# EAGLE schematic Timer Autoradio NE555+CD4093 (EAGLE 6.4)
Circuito per mantenere l'autoradio acceso per ancora 15 minuti dopo aver spento la macchina.
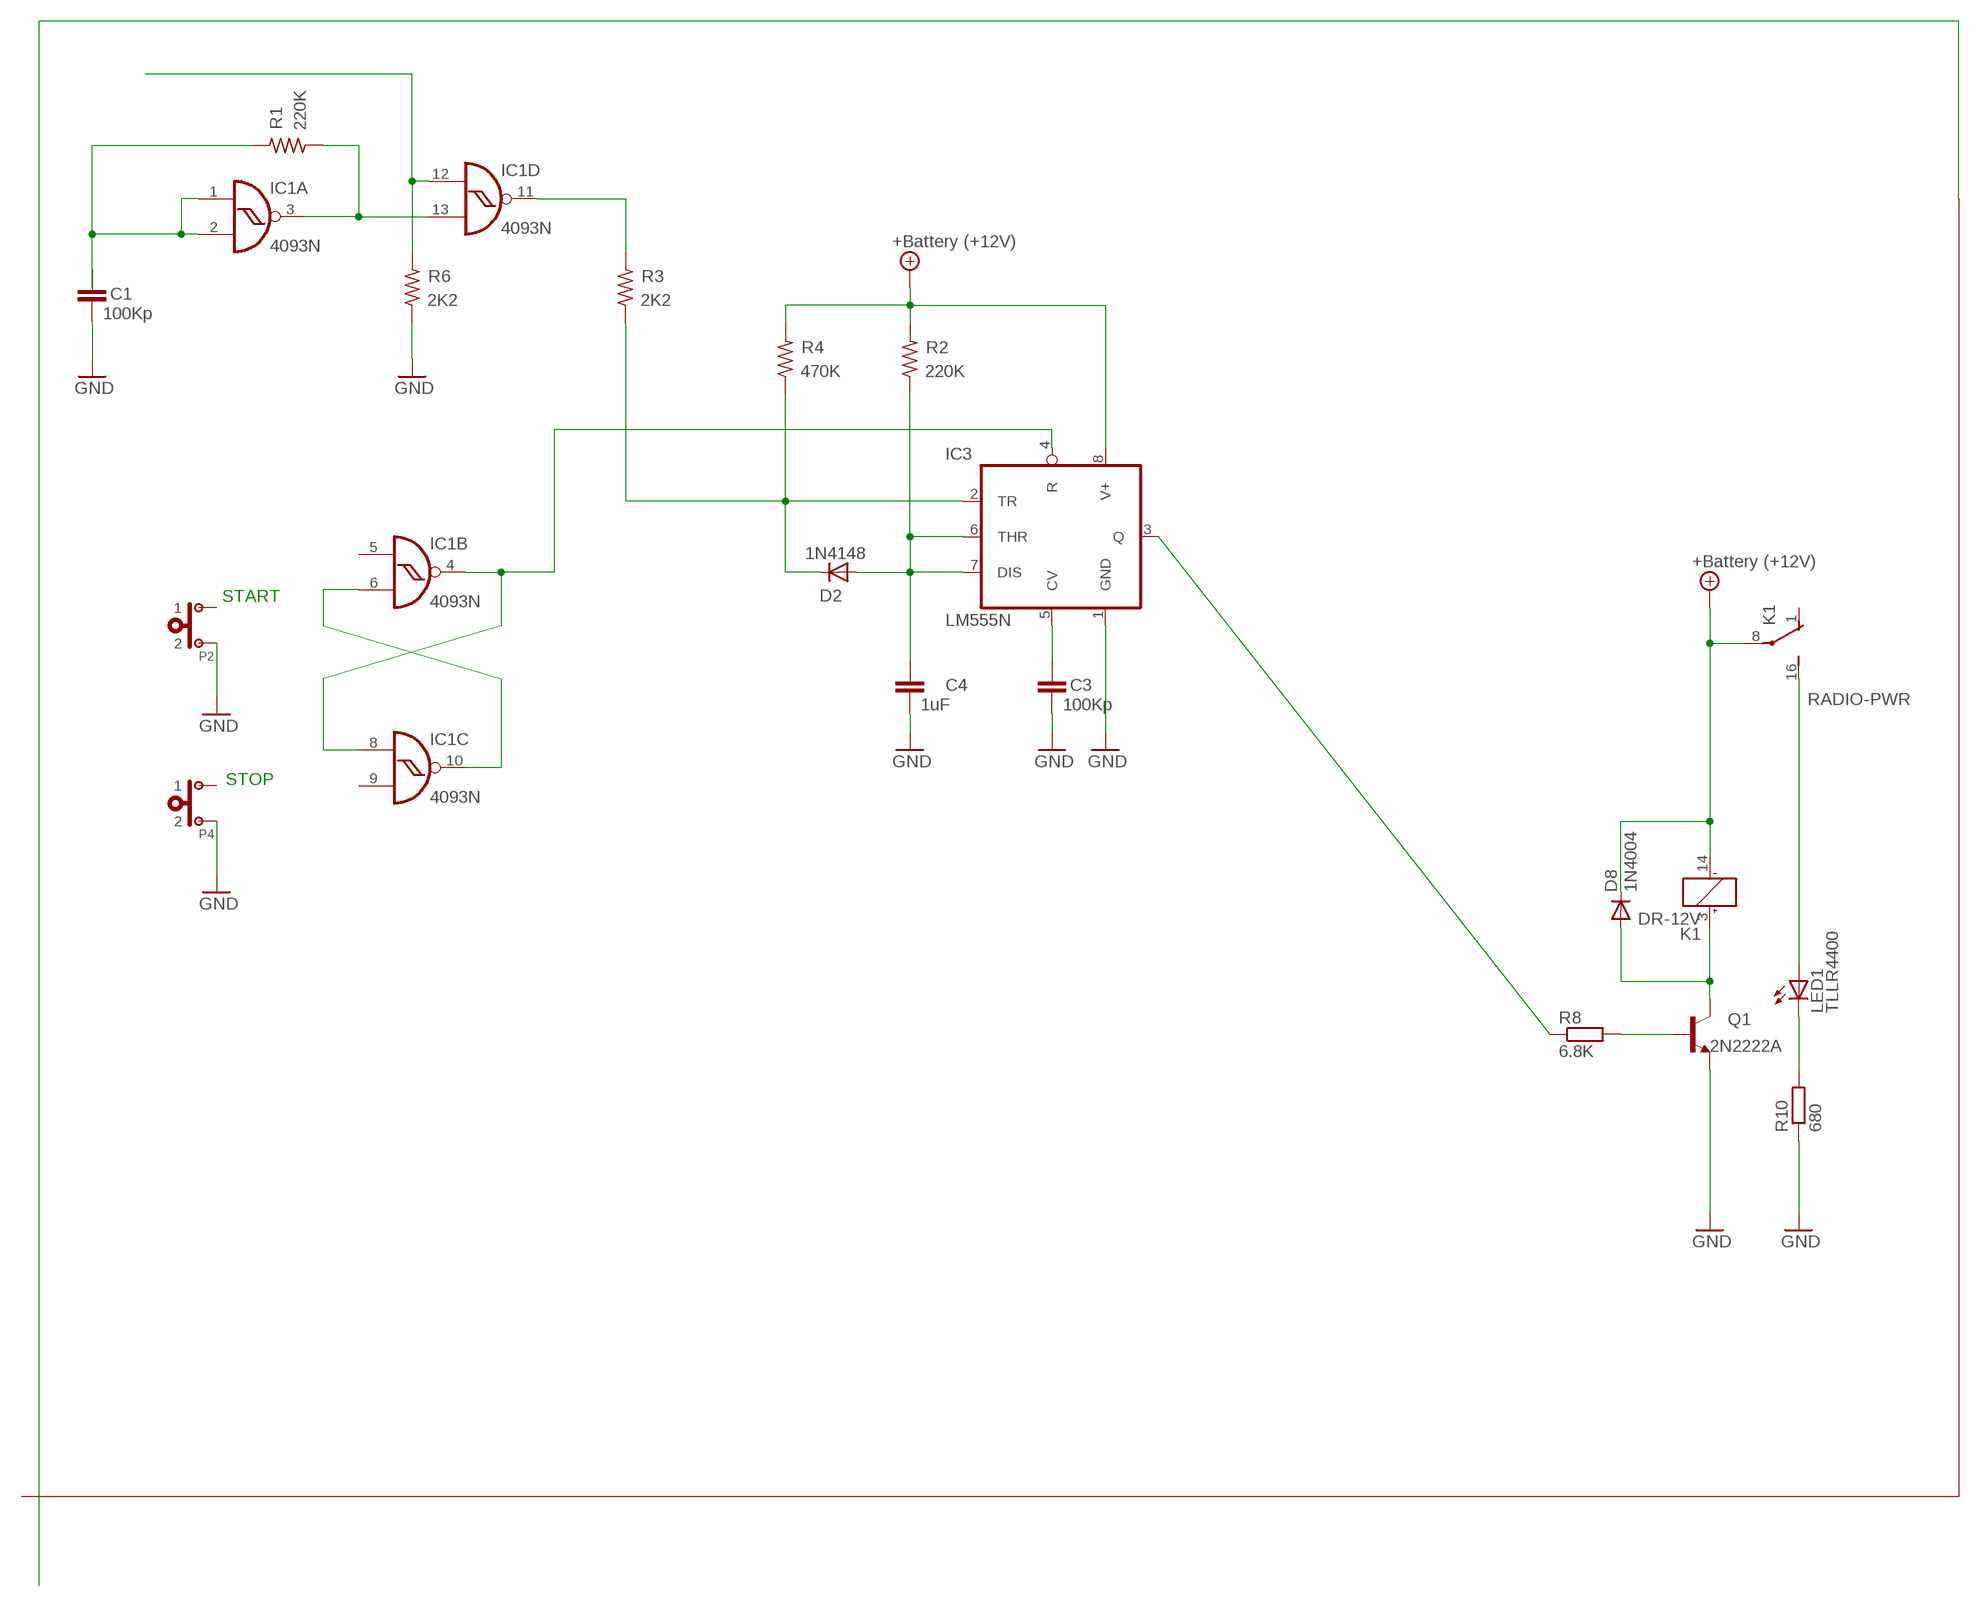
[diagram p0: schematic, sheet 1]

## Parts
C1  100Kp  C-EU025-025X050  [C025-025X050]
C3  100Kp  C-EU025-025X050  [C025-025X050]
C4  1uF  C-EU025-025X050  [C025-025X050]
D2  1N4148  1N4148DO35-10  [DO35-10]
D8  1N4004  [DO41-10]
IC1  4093N  [DIL14]
IC3  LM555N  [DIL08]
K1  DR-12V  [DR-1]
LED1  TLLR4400  [LED3MM]
P2  PULSANTENO  [SIP02]
P4  PULSANTENO  [SIP02]
Q1  2N2222A  [TO18]
R1  220K  R-US_0207/12  [0207/12]
R2  220K  R-US_0207/12  [0207/12]
R3  2K2  R-US_0207/12  [0207/12]
R4  470K  R-US_0207/12  [0207/12]
R6  2K2  R-US_0207/12  [0207/12]
R8  6.8K  R-EU_0207/10  [0207/10]
R10  680  R-EU_0207/10  [0207/10]

## Nets
+12V: D8.C IC3.8(V+) K1.8(-2:P) K1.14(-1:-) R2.2 R4.2 ; supply symbol labelled +Battery (+12V)
GND: IC3.1(GND) P2.2 P4.2 Q1.1(E) R6.1 R10.1
N$2: Q1.2(B) R8.2
N$3: D8.A K1.3(-1:+) Q1.3(C)
N$4: C3.1 IC3.5(CV)
N$5: IC1.3(A:O) R1.1
N$6: IC1.12(D:I0) R6.2
N$7: C1.1 IC1.1(A:I0) IC1.2(A:I1) R1.2
N$8: LED1.K(C) R10.2
N$9: IC1.11(D:O) R3.2
N$11: IC3.3(Q) R8.1
N$12: IC1.6(B:I1) IC1.10(C:O)
N$13: IC1.4(B:O) IC1.8(C:I0) IC3.4(R)
N$14: D2.C IC3.2(TR) R3.1 R4.1
N$18: C4.1 D2.A IC3.6(THR) IC3.7(DIS) R2.1
RADIO-PWR: K1.16(-2:S) LED1.A
Unconnected: C1.2 C3.2 C4.2 IC1.5(B:I0) IC1.9(C:I1) IC1.13(D:I1) K1.1(-2:O) P2.1 P4.1

## Notes on the sheet
- START
- STOP

## Power pins joined to a net without a drawn wire
VDD: IC1.14(P:VDD)
VSS: IC1.7(P:VSS)

## Library data of the parts
C1 C3 C4 = rcl:C-EU: CAPACITOR, European symbol
D2 = diode:1N4148: DIODE high speed (Philips)
D8 = diode:1N4004: DIODE general purpose rectifier, 1 A
IC1 = Ln-40xx:4093: Quad 2-input NAND schmitt trigger
IC3 = Ln-linear:*555: TIMER
K1 = relay:DR-*V: HIGHLY RELIABLE MINIATURE DIP RELAYS NAiS Source: www.mew-europe.com/ac/download/ datasheet/relay/dr_en.pdf; MPN: DR-12V; OC_FARNELL: 1124066; OC_NEWARK: 91K6794
LED1 = Loreto:TLLR4400: Low Current (2mA) LED 3 mm Tinted Diffused Package color RED Source: Data sheet <http://www.farnell.com/datasheets/391100.pdf>; MF: VISHAY SEMICONDUCTOR; OC_FARNELL: 1612437
P2 P4 = Ln-Varie:PULSANTENO: Pulsante NO
Q1 = transistor-npn:2N2222*: NPN Transistor
R1-R4 R6 = rcl:R-US_: RESISTOR, American symbol
R8 R10 = rcl:R-EU_: RESISTOR, European symbol